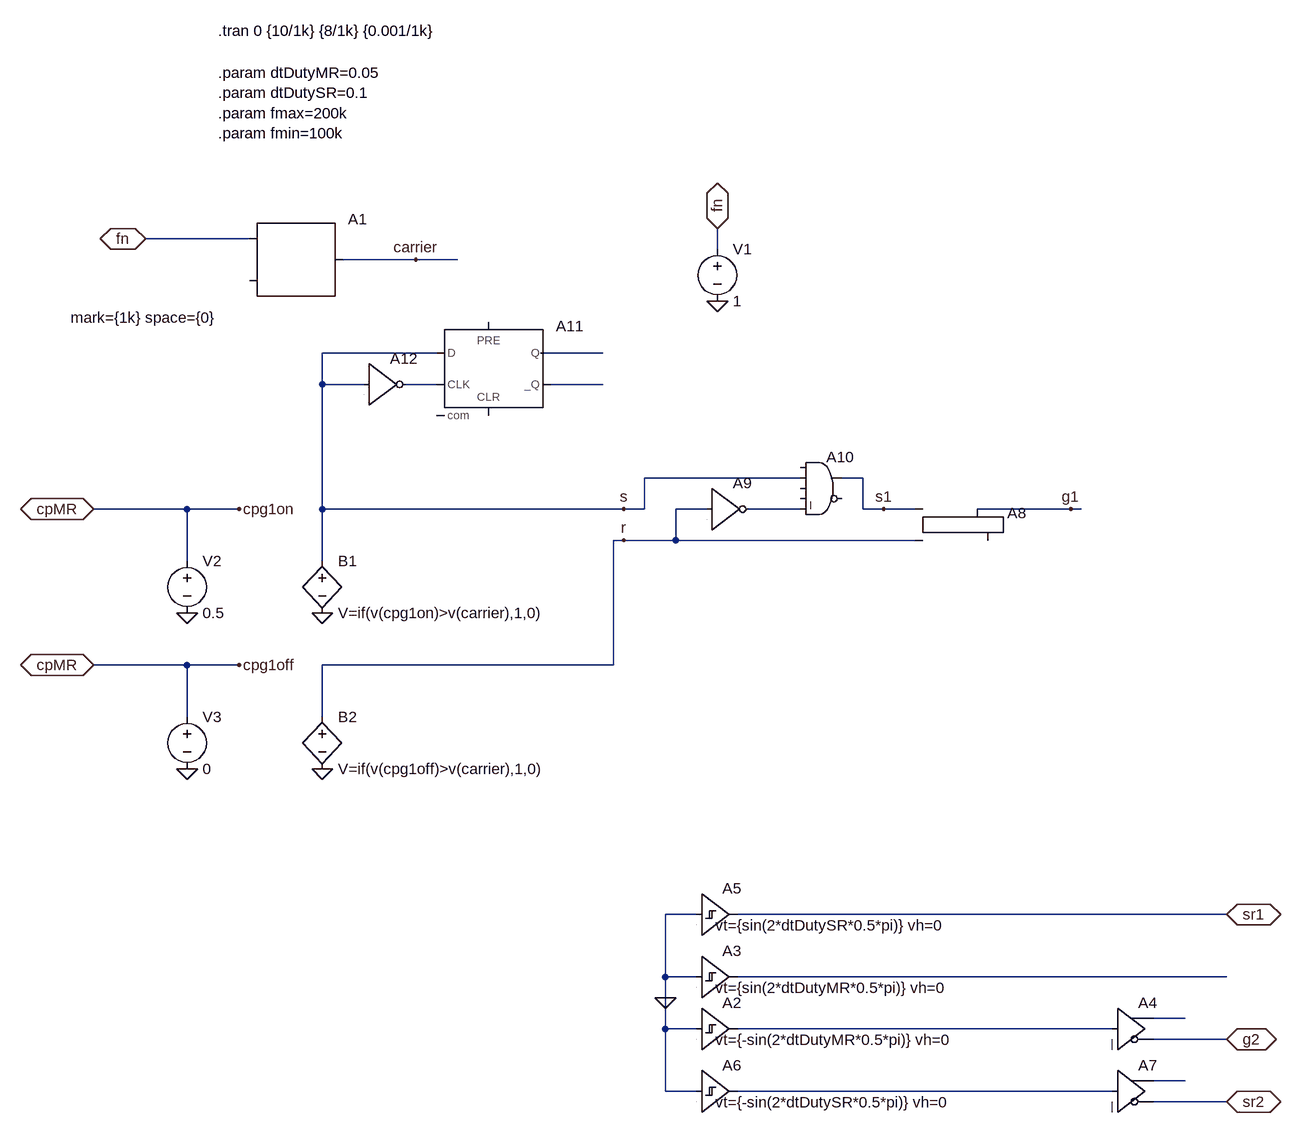
[diagram p0: schematic userLib_PFM_v0.2.asc]
userLib_PFM_v0.2.asc, the LTspice schematic file:
Version 4.1
SHEET 1 1884 1224
WIRE 192 -288 32 -288
WIRE 912 -272 912 -304
WIRE 448 -256 336 -256
WIRE 512 -256 448 -256
WIRE 480 -112 304 -112
WIRE 736 -112 640 -112
WIRE 304 -64 304 -112
WIRE 368 -64 304 -64
WIRE 480 -64 432 -64
WIRE 736 -64 656 -64
WIRE 1040 80 800 80
WIRE 1136 80 1104 80
WIRE 96 128 -48 128
WIRE 176 128 96 128
WIRE 304 128 304 -64
WIRE 768 128 304 128
WIRE 800 128 800 80
WIRE 800 128 768 128
WIRE 896 128 848 128
WIRE 1040 128 960 128
WIRE 1136 128 1136 80
WIRE 1168 128 1136 128
WIRE 1216 128 1168 128
WIRE 1456 128 1312 128
WIRE 1472 128 1456 128
WIRE 768 176 752 176
WIRE 848 176 848 128
WIRE 848 176 768 176
WIRE 1216 176 848 176
WIRE 96 208 96 128
WIRE 304 208 304 128
WIRE 96 368 -48 368
WIRE 176 368 96 368
WIRE 752 368 752 176
WIRE 752 368 304 368
WIRE 96 448 96 368
WIRE 304 448 304 368
WIRE 880 752 832 752
WIRE 1696 752 944 752
WIRE 832 848 832 752
WIRE 880 848 832 848
WIRE 1696 848 944 848
WIRE 832 880 832 848
WIRE 1632 912 1584 912
WIRE 832 928 832 880
WIRE 880 928 832 928
WIRE 1520 928 944 928
WIRE 1696 944 1584 944
WIRE 1632 1008 1584 1008
WIRE 832 1024 832 928
WIRE 880 1024 832 1024
WIRE 1520 1024 944 1024
WIRE 1696 1040 1584 1040
FLAG 32 -288 fn
IOPIN 32 -288 BiDir
FLAG 1696 944 g2
IOPIN 1696 944 BiDir
FLAG 1696 752 sr1
IOPIN 1696 752 BiDir
FLAG 1696 1040 sr2
IOPIN 1696 1040 BiDir
FLAG 912 -192 0
FLAG 912 -304 fn
IOPIN 912 -304 BiDir
FLAG 176 128 cpg1on
FLAG -48 128 cpMR
IOPIN -48 128 BiDir
FLAG 448 -256 carrier
FLAG 304 288 0
FLAG 832 880 0
FLAG 96 288 0
FLAG 176 368 cpg1off
FLAG -48 368 cpMR
IOPIN -48 368 BiDir
FLAG 304 528 0
FLAG 96 528 0
FLAG 1456 128 g1
FLAG 768 128 s
FLAG 768 176 r
FLAG 1168 128 s1
SYMBOL SpecialFunctions\\modulate 192 -288 R0
WINDOW 3 -275 121 Left 2
SYMATTR Value mark={1k} space={0}
SYMATTR InstName A1
SYMBOL Digital\\schmtbuf 880 784 R0
WINDOW 123 29 81 Left 2
SYMATTR Value2 vt={sin(2*dtDutyMR*0.5*pi)} vh=0
SYMATTR InstName A3
SYMBOL Digital\\schmtbuf 880 864 R0
WINDOW 123 29 81 Left 2
SYMATTR Value2 vt={-sin(2*dtDutyMR*0.5*pi)} vh=0
SYMATTR InstName A2
SYMBOL Digital\\buf 1520 864 R0
SYMATTR InstName A4
SYMBOL Digital\\schmtbuf 880 688 R0
WINDOW 123 29 81 Left 2
SYMATTR Value2 vt={sin(2*dtDutySR*0.5*pi)} vh=0
SYMATTR InstName A5
SYMBOL Digital\\schmtbuf 880 960 R0
WINDOW 123 29 81 Left 2
SYMATTR Value2 vt={-sin(2*dtDutySR*0.5*pi)} vh=0
SYMATTR InstName A6
SYMBOL Digital\\buf 1520 960 R0
SYMATTR InstName A7
SYMBOL voltage 912 -288 R0
SYMATTR InstName V1
SYMATTR Value 1
SYMBOL bv 304 192 R0
SYMATTR InstName B1
SYMATTR Value V=if(v(cpg1on)>v(carrier),1,0)
SYMBOL voltage 96 192 R0
SYMATTR InstName V2
SYMATTR Value 0.5
SYMBOL Digital\\srflop 1264 80 R0
SYMATTR InstName A8
SYMBOL bv 304 432 R0
SYMATTR InstName B2
SYMATTR Value V=if(v(cpg1off)>v(carrier),1,0)
SYMBOL voltage 96 432 R0
SYMATTR InstName V3
SYMATTR Value 0
SYMBOL Digital\\inv 896 64 R0
SYMATTR InstName A9
SYMBOL Digital\\and 1072 32 R0
SYMATTR InstName A10
SYMBOL Digital\\dflop 560 -160 R0
SYMATTR InstName A11
SYMBOL Digital\\inv 368 -128 R0
SYMATTR InstName A12
TEXT 144 -544 Left 2 !.param dtDutyMR=0.05\n.param dtDutySR=0.1\n.param fmax=200k\n.param fmin=100k
TEXT 144 -608 Left 2 !.tran 0 {10/1k} {8/1k} {0.001/1k}

The netlist it stands for:
* userLib_PFM_v0.2.asc
A1 fn 0 0 0 0 0 carrier 0 MODULATOR mark={1k} space={0}
A3 0 0 0 0 0 0 N005 0 SCHMITT vt={sin(2*dtDutyMR*0.5*pi)} vh=0
A2 0 0 0 0 0 0 N007 0 SCHMITT vt={-sin(2*dtDutyMR*0.5*pi)} vh=0
A4 N007 0 0 0 0 g2 N006 0 BUF
A5 0 0 0 0 0 0 sr1 0 SCHMITT vt={sin(2*dtDutySR*0.5*pi)} vh=0
A6 0 0 0 0 0 0 N009 0 SCHMITT vt={-sin(2*dtDutySR*0.5*pi)} vh=0
A7 N009 0 0 0 0 sr2 N008 0 BUF
V1 fn 0 1
B1 s 0 V=if(v(cpg1on)>v(carrier),1,0)
V2 cpg1off 0 0.5
A8 s1 r 0 0 0 0 g1 0 SRFLOP
B2 r 0 V=if(v(cpg1off)>v(carrier),1,0)
V3 cpg1off 0 0
A9 r 0 0 0 0 N004 0 0 BUF
A10 0 s 0 0 N004 0 s1 0 AND
A11 s 0 N002 0 0 N003 N001 0 DFLOP
A12 s 0 0 0 0 N002 0 0 BUF
.param dtDutyMR=0.05
.param dtDutySR=0.1
.param fmax=200k
.param fmin=100k
.tran 0 {10/1k} {8/1k} {0.001/1k}
.backanno
.end